# Altium schematic sheet [04] - INDICATORS.SchDoc: Desk Digital Clock
size A4; DrawnBy: Ramil Teregulov; Address1: http://github.com/teregulov; Address2: http://github.com/teregulov/Desk-Digital-Clock; DocumentNumber: DDC-3; Revision: 1R0; SheetNumber: 3; SheetTotal: 7
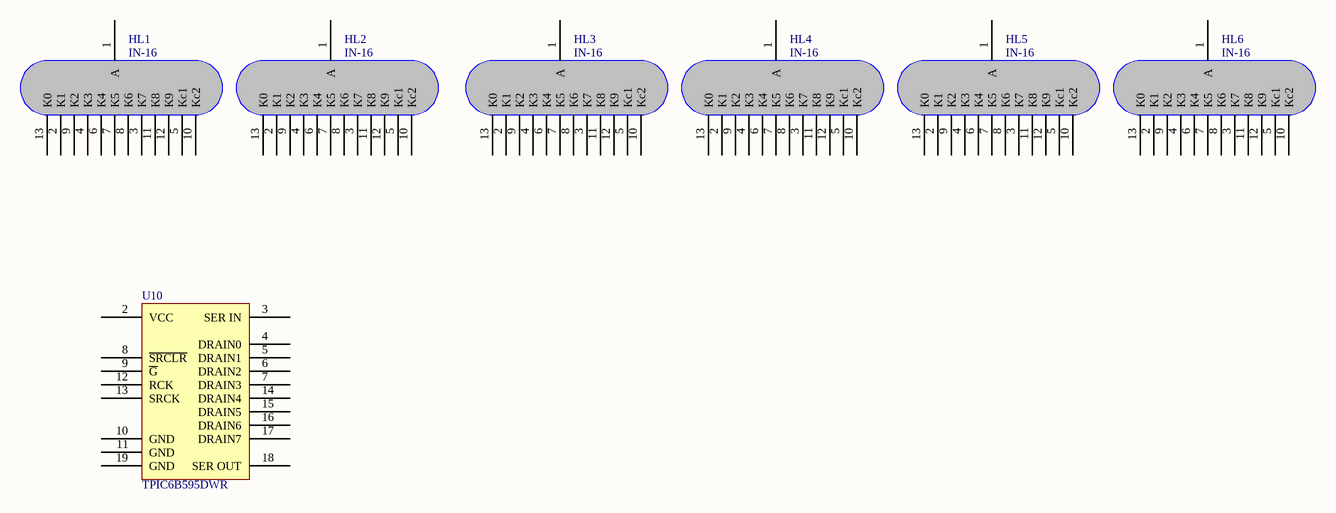
[diagram p0: [04] - INDICATORS.SchDoc]

## Parts
HL1  IN-16  [IN-16]
HL2  IN-16  [IN-16]
HL3  IN-16  [IN-16]
HL4  IN-16  [IN-16]
HL5  IN-16  [IN-16]
HL6  IN-16  [IN-16]
U10  TPIC6B595DWR  [SOP127P1030X265-20N]

## Nets

Not connected (* = marked no-connect by the designer): HL1 1(A) 2(K1) 3(K7) 4(K3) 5(Kc1) 6(K4) 7(K5) 8(K6) 9(K2) 10(Kc2) 11(K8) 12(K9) 13(K0); HL2 1(A) 2(K1) 3(K7) 4(K3) 5(Kc1) 6(K4) 7(K5) 8(K6) 9(K2) 10(Kc2) 11(K8) 12(K9) 13(K0); HL3 1(A) 2(K1) 3(K7) 4(K3) 5(Kc1) 6(K4) 7(K5) 8(K6) 9(K2) 10(Kc2) 11(K8) 12(K9) 13(K0); HL4 1(A) 2(K1) 3(K7) 4(K3) 5(Kc1) 6(K4) 7(K5) 8(K6) 9(K2) 10(Kc2) 11(K8) 12(K9) 13(K0); HL5 1(A) 2(K1) 3(K7) 4(K3) 5(Kc1) 6(K4) 7(K5) 8(K6) 9(K2) 10(Kc2) 11(K8) 12(K9) 13(K0); HL6 1(A) 2(K1) 3(K7) 4(K3) 5(Kc1) 6(K4) 7(K5) 8(K6) 9(K2) 10(Kc2) 11(K8) 12(K9) 13(K0); U10 2(VCC) 3(SER_IN) 4(DRAIN0) 5(DRAIN1) 6(DRAIN2) 7(DRAIN3) 8(~{SRCLR}) 9(~{G}) 10(GND) 11(GND) 12(RCK) 13(SRCK) 14(DRAIN4) 15(DRAIN5) 16(DRAIN6) 17(DRAIN7) 18(SER_OUT) 19(GND)

## Notes on the sheet
- Title:
- Size:
- Date:
- A4
- Number:
- Time:
- Revision:
- Sheet
- of
- File:

## Library data of the parts
U10 = TPIC6B595DWR: Power Logic 8-Bit Shift Register; Manufacturer: Texas Instruments; Datasheet: https://static.chipdip.ru/lib/542/DOC012542376.pdf; P/N: TPIC6B595DWR
HL1-HL6 = IN-16: P/N: IN-16